# Altium schematic sheet fpga.SchDoc
size Letter
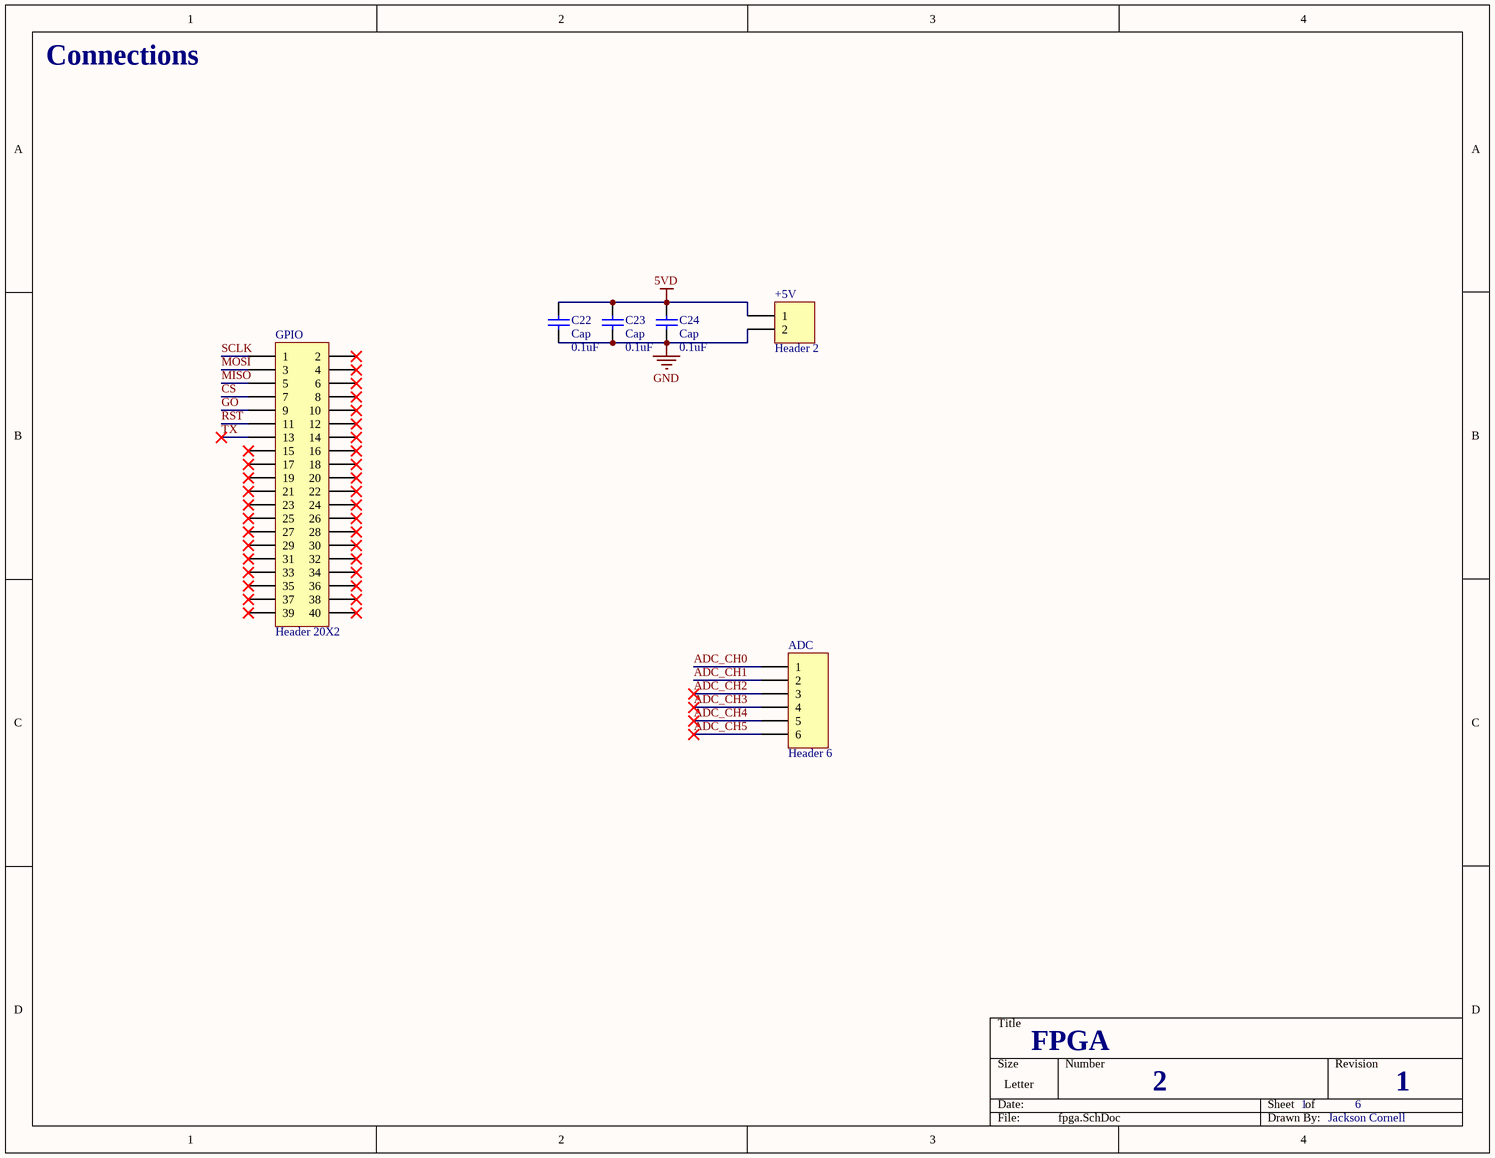
[diagram p0: fpga.SchDoc]

## Parts
+5V  Header 2  [HDR1X2]
ADC  Header 6  [HDR1X6]
C22  Cap  value 0.1uF  [CAPC0805]
C23  Cap  value 0.1uF  [CAPC0805]
C24  Cap  value 0.1uF  [CAPC0805]
GPIO  Header 20X2  [HDR2X20]

## Nets
5VD: +5V.1 C22.2 C23.2 C24.2
GND: +5V.2 C22.1 C23.1 C24.1
ADC_CH0: ADC.1
ADC_CH1: ADC.2
ADC_CH2: ADC.3
ADC_CH3: ADC.4
ADC_CH4: ADC.5
ADC_CH5: ADC.6
CS: GPIO.7
GO: GPIO.9
MISO: GPIO.5
MOSI: GPIO.3
RST: GPIO.11
SCLK: GPIO.1
TX: GPIO.13

Not connected (* = marked no-connect by the designer): GPIO 2* 4* 6* 8* 10* 12* 14* 15* 16* 17* 18* 19* 20* 21* 22* 23* 24* 25* 26* 27* 28* 29* 30* 31* 32* 33* 34* 35* 36* 37* 38* 39* 40*

## Notes on the sheet
- Connections
- FPGA
- 2
- 1
- 6
- Jackson Cornell

## Library data of the parts
+5V = Header 2: Header, 2-Pin; LatestRevisionDate: 17-Jul-2002; LatestRevisionNote: Re-released for DXP Platform.; Publisher: Altium Limited
ADC = Header 6: Header, 6-Pin; LatestRevisionDate: 17-Jul-2002; LatestRevisionNote: Re-released for DXP Platform.; Publisher: Altium Limited
C22-C24 = Cap: Capacitor; Published: 8-Jun-2000; LatestRevisionDate: 17-Jul-2002; LatestRevisionNote: Re-released for DXP Platform.; PackageReference: RAD-0.3; Publisher: Altium Limited; PackageDescription: Radial Cap, Thru-Hole; 2 Leads; 0.3 in Pin Spacing
GPIO = Header 20X2: Header, 20-Pin, Dual row; LatestRevisionDate: 17-Jul-2002; LatestRevisionNote: Re-released for DXP Platform.; Publisher: Altium Limited